# Altium project Nhúng.PrjPcb
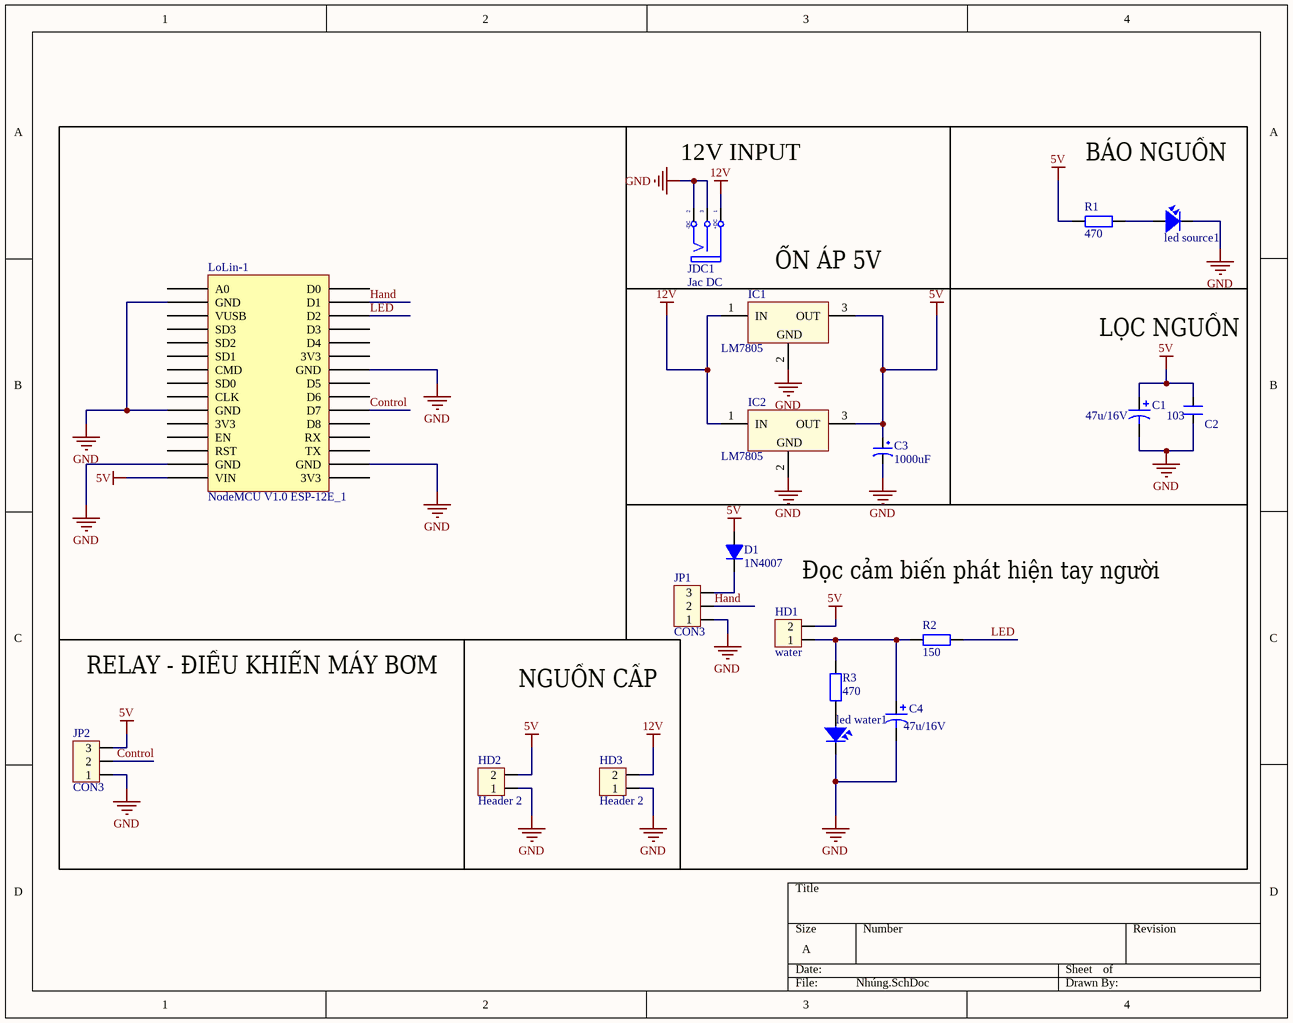
[diagram p0: Nhúng.SchDoc]
1 sheet, 19 parts. Net scope: global (net labels, ports and power ports of the same name join across sheets).
Board file: Nhúng.PcbDoc

## Sheet Nhúng.SchDoc
size A

### Parts
C1  47u/16V  [C3MM]
C2  103  [CN1]
C3  1000uF  [CP1/2]
C4  47u/16V  [C3MM]
D1  1N4007  [D1A]
HD1  water  [HED2]
HD2  Header 2  [HED2]
HD3  Header 2  [HED2]
IC1  LM7805  [QTO-220]
IC2  LM7805  [QTO-220]
JDC1  Jac DC  [DC-IN]
JP1  CON3  [jam3]
JP2  CON3  [jam3]
led_source1  LED  [LED-3]  (value not drawn)
led_water1  LED  [LED-3]  (value not drawn)
LoLin-1  NodeMCU V1.0 ESP-12E_1  [LoLin NodeMcu V3]
R1  470  [R1/4W]
R2  150  [R1/4W]
R3  470  [R1/4W]

### Nets
5V: C1.1 C2.2 C3.1 D1.1(A) HD1.2 HD2.2 IC1.3(OUT) IC2.3(OUT) JP2.3 LoLin-1.VIN R1.1
12V: HD3.2 IC1.1(IN) IC2.1(IN) JDC1.1(T)
GND: C1.2 C2.1 C3.2 C4.2 HD2.1 HD3.1 IC1.2(GND) IC2.2(GND) JDC1.2(TN) JDC1.3(S) JP1.1 JP2.1 led_source1.2 led_water1.2 LoLin-1.GND
Control: JP2.2 LoLin-1.D7
Hand: JP1.2 LoLin-1.D1
LED: LoLin-1.D2 R2.1
NetC4_1: C4.1 HD1.1 R2.2 R3.2
NetD1_2: D1.2(K) JP1.3
Netled_source1_1: led_source1.1 R1.2
Netled_water1_1: led_water1.1 R3.1

Not connected (* = marked no-connect by the designer): LoLin-1 3V3 A0 CLK CMD D0 D3 D4 D5 D6 D8 EN RST RX SD0 SD1 SD2 SD3 TX VUSB

### Notes on the sheet
- 12V INPUT
- BÁO NGUỒN
- ỔN ÁP 5V
- LỌC NGUỒN
- Đọc cảm biến phát hiện tay người
- RELAY - ĐIỀU KHIỂN MÁY BƠM
- NGUỒN CẤP
- (in symbol DCIN) -DC; +DC

### Library data of the parts
C1 C4 = Cap Pol: Polarized Capacitor (Axial); Published: 8-Jun-2000; LatestRevisionDate: 17-Jul-2002; LatestRevisionNote: Re-released for DXP Platform.; PackageReference: POLAR0.8; Publisher: Altium Limited
C2 = CAP gom
C3 = CP1: Cap P  0,1uF < 22uF , 16 - 50V; Value: 10uF/50V; Description 1: 10 => 220uF/6,3V/10V - 10uF => 100uF/16V; Description 2: 0,1uF => 33uF/50V - 10uF => 22uF/63V; Description 3: 0,47uF => 10uF/100V
D1 = D1A: Diode 1A; Value: 1N4007
HD1-HD3 = Header 2: Header 2 (Green); Value: Header 2
IC1 IC2 = LM78xx: On ap +, from + 5 to + 24VDC; Value: LM7805
JDC1 = DCIN: Jac DC input; Value: Jac DC
JP1 JP2 = jam 3: Value: Connector 3
led_source1 led_water1 = LED: LED Single colour Green and Red; Value: LED 3 ly Single Colour
LoLin-1 = NodeMCU V1.0 ESP-12E_1: LoLin NodeMCU V3
R1-R3 = R1/4W: Resistor 1/4W; Value: R1/4W - 1K